# Altium project CanSat.PrjPcb
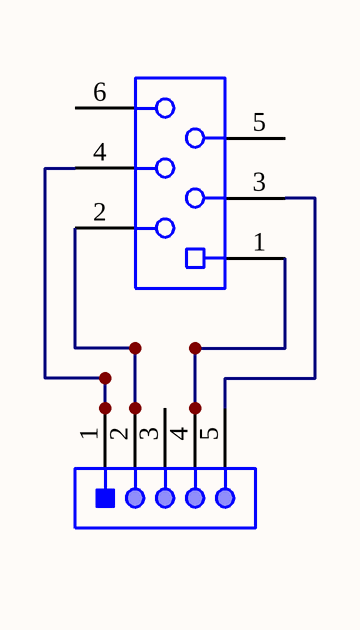
[diagram p0: SCD41_schema.SchDoc]
1 sheet, 2 parts. Net scope: global (net labels, ports and power ports of the same name join across sheets).
Board file: SDC41_PCB.PcbDoc

## Sheet SCD41_schema.SchDoc
size A4; SheetNumber: 1; SheetTotal: 1

### Parts
?  (no value)  [690367280676]
P?  (no value)  [61300511121]

### Nets
Net?_1: ?.1 P?.4
Net?_2: ?.2 P?.2
Net?_3: ?.3 P?.5
Net?_4: ?.4 P?.1

Not connected (* = marked no-connect by the designer): ? 5 6; P? 3

### Library data of the parts
? = CMP-1502-00818-1: Female SMT Straight Connector without Latch and with Polarization WR-MM, 6 pins; Manufacturer: Wurth Elektronik; Working Voltage: 100VAC; Pin Number: 6; Rated Current: 1.5A; Contact Resistance: 10mOhm; Pitch: 2.54mm; Insulation Resistance: >1000MOhm; Withstanding Voltage: 500VAC
P? = CMP-1502-01068-1: THT Vertical Pin Header WR-PHD, Pitch 2.54 mm, Single Row, 5 pins; Manufacturer: Wurth Elektronik; Pin Number: 5; Contact Resistance: 20mOhm; Working Voltage: 250VAC; Pitch: 2.54mm; Withstanding Voltage: 500VAC; Rated Current: 3A; Gender: Male